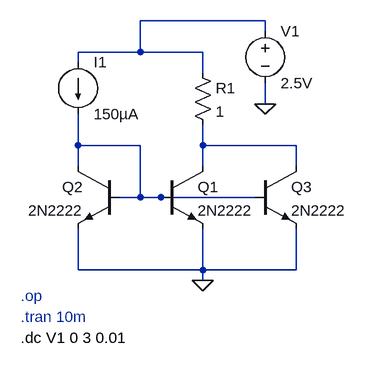
[diagram p0: schematic curent mirror bjt(cs).asc]
curent mirror bjt(cs).asc, the LTspice schematic file:
Version 4.1
SHEET 1 880 680
WIRE 400 -32 208 -32
WIRE 400 -16 400 -32
WIRE 208 16 208 -32
WIRE 208 16 112 16
WIRE 304 16 208 16
WIRE 112 32 112 16
WIRE 304 48 304 16
WIRE 400 96 400 64
WIRE 112 160 112 112
WIRE 208 160 112 160
WIRE 304 160 304 128
WIRE 448 160 304 160
WIRE 112 192 112 160
WIRE 304 192 304 160
WIRE 448 192 448 160
WIRE 208 240 208 160
WIRE 208 240 176 240
WIRE 240 240 208 240
WIRE 384 240 240 240
WIRE 112 352 112 288
WIRE 304 352 304 288
WIRE 304 352 112 352
WIRE 448 352 448 288
WIRE 448 352 304 352
WIRE 304 368 304 352
FLAG 304 368 0
FLAG 400 96 0
SYMBOL npn 240 192 R0
SYMATTR InstName Q1
SYMATTR Value 2N2222
SYMBOL npn 176 192 M0
SYMATTR InstName Q2
SYMATTR Value 2N2222
SYMBOL npn 384 192 R0
SYMATTR InstName Q3
SYMATTR Value 2N2222
SYMBOL voltage 400 -32 R0
SYMATTR InstName V1
SYMATTR Value 2.5V
SYMBOL current 112 32 R0
SYMATTR InstName I1
SYMATTR Value 150µA
SYMBOL res 288 32 R0
SYMATTR InstName R1
SYMATTR Value 1
TEXT 24 392 Left 2 ;.op
TEXT 24 424 Left 2 ;.tran 10m
TEXT 24 456 Left 2 !.dc V1 0 3 0.01

The netlist it stands for:
* curent mirror bjt(cs).asc
Q1 N003 N002 0 0 2N2222
Q2 N002 N002 0 0 2N2222
Q3 N003 N002 0 0 2N2222
V1 N001 0 2.5V
I1 N001 N002 150µA
R1 N001 N003 1
.model NPN NPN
.model PNP PNP
.lib standard.bjt
* .op
* .tran 10m
.dc V1 0 3 0.01
.backanno
.end